# Altium schematic sheet BLDC.SchDoc
size A3
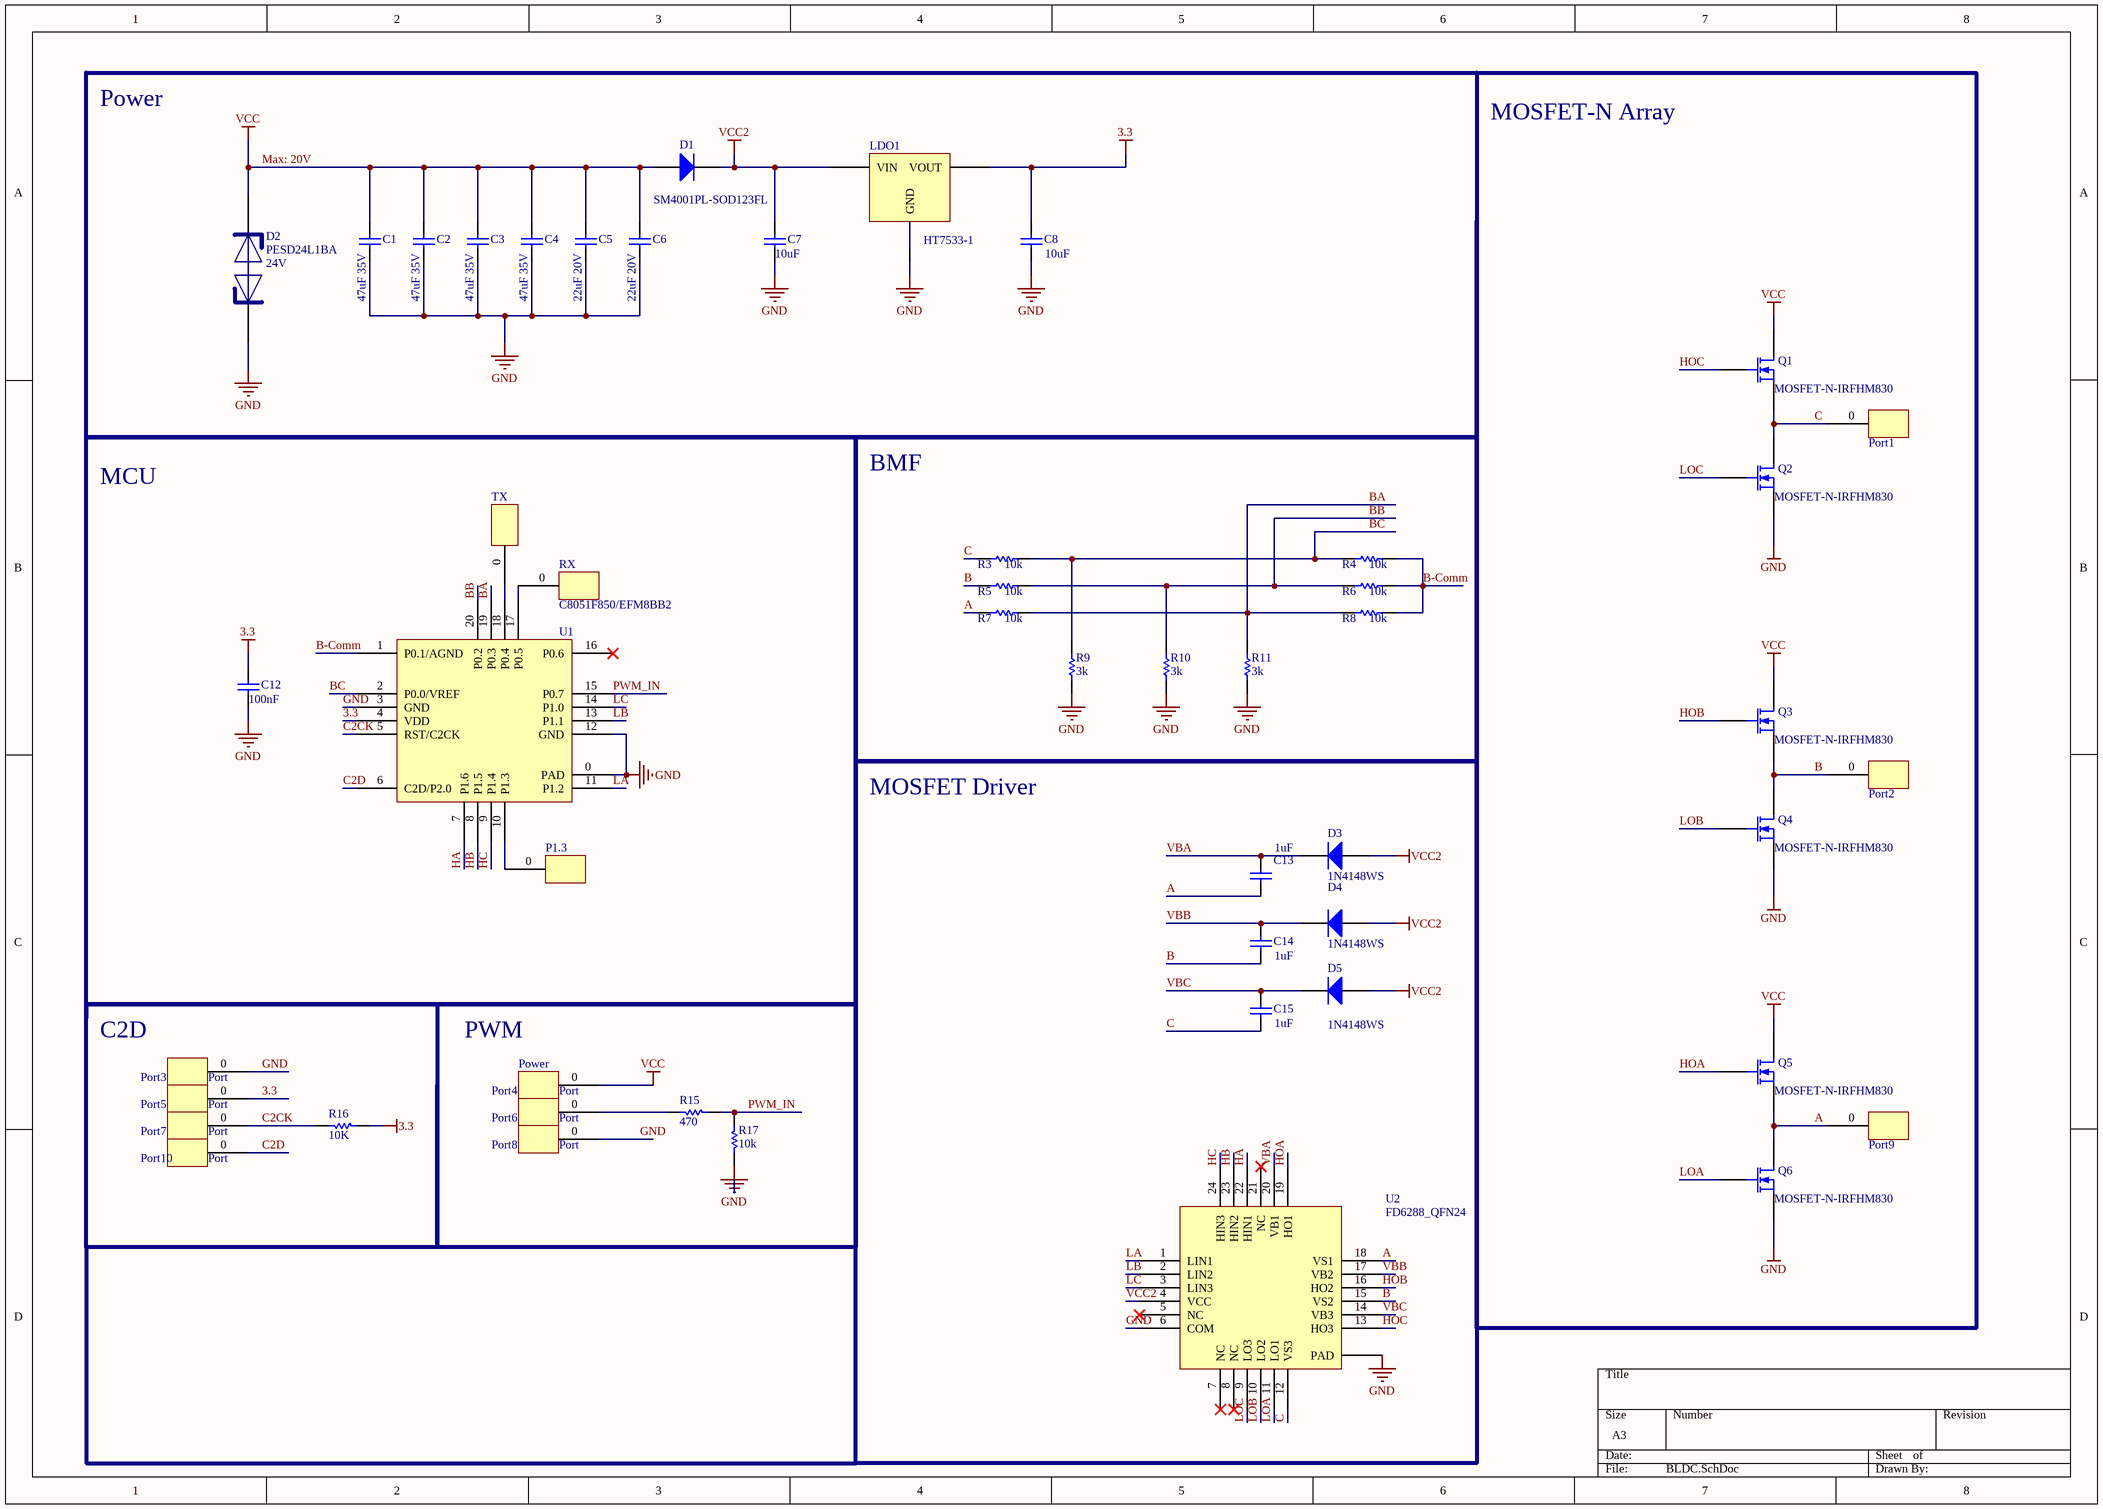
[diagram p0: BLDC.SchDoc]

## Parts
C1  value 47uF 35V  [1206_HIGH]  (hidden comment: Cap)
C2  value 47uF 35V  [1206_HIGH]  (hidden comment: Cap)
C3  value 47uF 35V  [1206_HIGH]  (hidden comment: Cap)
C4  value 47uF 35V  [1206_HIGH]  (hidden comment: Cap)
C5  value 22uF 20V  [1206_HIGH]  (hidden comment: Cap)
C6  value 22uF 20V  [1206_HIGH]  (hidden comment: Cap)
C7  value 10uF  [0603_HIGH]  (hidden comment: Cap)
C8  value 10uF  [0603_HIGH]  (hidden comment: Cap)
C12  value 100nF  [0402_High]  (hidden comment: Cap)
C13  value 1uF  [0603_HIGH]  (hidden comment: Cap)
C14  value 1uF  [0603_HIGH]  (hidden comment: Cap)
C15  value 1uF  [0603_HIGH]  (hidden comment: Cap)
D1  SM4001PL-SOD123FL  [SOD123]
D2  PESD24L1BA  value 24V  [SODFL250X110-2N]
D3  1N4148WS  [LC-SOD-323]
D4  1N4148WS  [LC-SOD-323]
D5  1N4148WS  [LC-SOD-323]
LDO1  HT7533-1  [SOT89-150P348X160-3N]
P1.3  Port  [DEBUG_POINT]  (value not drawn)
Port1  Port  [MOTOR_POINT]  (value not drawn)
Port2  Port  [MOTOR_POINT]  (value not drawn)
Port3  Port  [DEBUG_POINT]
Port4  Port  [POWER_POINT]
Port5  Port  [DEBUG_POINT]
Port6  Port  [MOTOR_POINT]
Port7  Port  [DEBUG_POINT]
Port8  Port  [POWER_POINT]
Port9  Port  [MOTOR_POINT]  (value not drawn)
Port10  Port  [DEBUG_POINT]
Q1  MOSFET-N-IRFHM830  [PQFN3X3]
Q2  MOSFET-N-IRFHM830  [PQFN3X3]
Q3  MOSFET-N-IRFHM830  [PQFN3X3]
Q4  MOSFET-N-IRFHM830  [PQFN3X3]
Q5  MOSFET-N-IRFHM830  [PQFN3X3]
Q6  MOSFET-N-IRFHM830  [PQFN3X3]
R3  value 10k  [0402_High]  (hidden comment: Res1)
R4  value 10k  [0402_High]  (hidden comment: Res1)
R5  value 10k  [0402_High]  (hidden comment: Res1)
R6  value 10k  [0402_High]  (hidden comment: Res1)
R7  value 10k  [0402_High]  (hidden comment: Res1)
R8  value 10k  [0402_High]  (hidden comment: Res1)
R9  value 3k  [0402_High]  (hidden comment: Res1)
R10  value 3k  [0402_High]  (hidden comment: Res1)
R11  value 3k  [0402_High]  (hidden comment: Res1)
R15  value 470  [0402_High]  (hidden comment: Res1)
R16  value 10K  [0402_High]  (hidden comment: Res1)
R17  value 10k  [0402_High]  (hidden comment: Res1)
RX  Port  [DEBUG_POINT]  (value not drawn)
TX  Port  [DEBUG_POINT]  (value not drawn)
U1  C8051F850/EFM8BB2  [QFN20]
U2  FD6288_QFN24  [QFN50P400X400X80_HS-25N]

## Blocks framed on the sheet
Power: C1-C8 D1 D2 LDO1
MCU: C12 P1.3 RX TX U1
BMF: R3-R11
MOSFET Driver: C13-C15 D3-D5 U2

## Nets
3.3: C8.1 C12.1 LDO1.3(VOUT) Port5.0(port) R16.1 U1.4(VDD)
GND: C1.2 C2.2 C3.2 C4.2 C5.2 C6.2 C7.2 C8.2 C12.2 D2.2 LDO1.1(GND) Port3.0(port) Port8.0(port) Q2.1(S) Q4.1(S) Q6.1(S) R9.2 R10.2 R11.2 R17.1 U1.0(PAD) U1.3(GND) U1.12(GND) U2.0(PAD) U2.6(COM)
VCC: C1.1 C2.1 C3.1 C4.1 C5.1 C6.1 D1.1(A) D2.1 Port4.0(port) Q1.3(D) Q3.3(D) Q5.3(D)
VCC2: C7.1 D1.2(K) D3.1(A) D4.1(A) D5.1(A) LDO1.2(VIN) U2.4(VCC)
A: C13.2 Port9.0(port) Q5.1(S) Q6.3(D) R7.2 U2.18(VS1)
B: C14.2 Port2.0(port) Q3.1(S) Q4.3(D) R5.2 U2.15(VS2)
B-Comm: R4.1 R6.1 R8.1 U1.1(P0.1/AGND)
BA: R7.1 R8.2 R11.1 U1.19(P0.3)
BB: R5.1 R6.2 R10.1 U1.20(P0.2)
BC: R3.1 R4.2 R9.1 U1.2(P0.0/VREF)
C: C15.2 Port1.0(port) Q1.1(S) Q2.3(D) R3.2 U2.12(VS3)
C2CK: Port7.0(port) R16.2 U1.5(RST/C2CK)
C2D: Port10.0(port) U1.6(C2D/P2.0)
HA: U1.7(P1.6) U2.22(HIN1)
HB: U1.8(P1.5) U2.23(HIN2)
HC: U1.9(P1.4) U2.24(HIN3)
HOA: Q5.2(G) U2.19(HO1)
HOB: Q3.2(G) U2.16(HO2)
HOC: Q1.2(G) U2.13(HO3)
LA: U1.11(P1.2) U2.1(LIN1)
LB: U1.13(P1.1) U2.2(LIN2)
LC: U1.14(P1.0) U2.3(LIN3)
LOA: Q6.2(G) U2.11(LO1)
LOB: Q4.2(G) U2.10(LO2)
LOC: Q2.2(G) U2.9(LO3)
PWM_IN: R15.2 R17.2 U1.15(P0.7)
VBA: C13.1 D3.2(K) U2.20(VB1)
VBB: C14.1 D4.2(K) U2.17(VB2)
VBC: C15.1 D5.2(K) U2.14(VB3)
NetP1.3_0: P1.3.0(port) U1.10(P1.3)
NetPort6_0: Port6.0(port) R15.1
NetRX_0: RX.0(port) U1.17(P0.5)
NetTX_0: TX.0(port) U1.18(P0.4)

Not connected (* = marked no-connect by the designer): U1 16(P0.6)*; U2 5(NC)* 7(NC)* 8(NC)* 21(NC)*

## Notes on the sheet
- Max: 20V
- MOSFET-N Array
- C2D
- PWM
- (near Port4) Power

## Library data of the parts
C1-C8 C12-C15 = Cap: Capacitor; Published: 8-Jun-2000; LatestRevisionDate: 17-Jul-2002; LatestRevisionNote: Re-released for DXP Platform.; PackageReference: RAD-0.3; Publisher: Altium Limited; PackageDescription: Radial Cap, Thru-Hole; 2 Leads; 0.3 in Pin Spacing
D1 D3-D5 = Diode: Default Diode; Published: 8-Jun-2000; LatestRevisionDate: 17-Jul-2002; LatestRevisionNote: Re-released for DXP Platform.; PackageVersion: Sep-1996; PackageReference: SMC; Publisher: Altium Limited; PackageDescription: DO-214-AB/SMC; 2 C-Bend Leads; Body 7.9 x 5.9 mm, inc. leads (LxW); Code_JEDEC: DO-214-AB
LDO1 = LDO
Q1-Q6 = MOSFET-N: N-Channel MOSFET; Published: 8-Jun-2000; LatestRevisionDate: 17-Jul-2002; LatestRevisionNote: Re-released for DXP Platform.; PackageVersion: 1995/1996; PackageReference: E3; Publisher: Altium Limited; PackageDescription: TO, Flat Index; 3 In-Line, Axial Leads; Body Dia. 4.6mm; Lead Dia. 0.5 mm (max)
R3-R11 R15-R17 = Res1: Resistor; Published: 8-Jun-2000; LatestRevisionDate: 17-Jul-2002; LatestRevisionNote: Re-released for DXP Platform.; PackageReference: AXIAL-0.3; Publisher: Altium Limited; PackageDescription: Axial Device, Thru-Hole; 2 Leads; 0.3 in Pin Spacing
U1 = C8051F850: U?